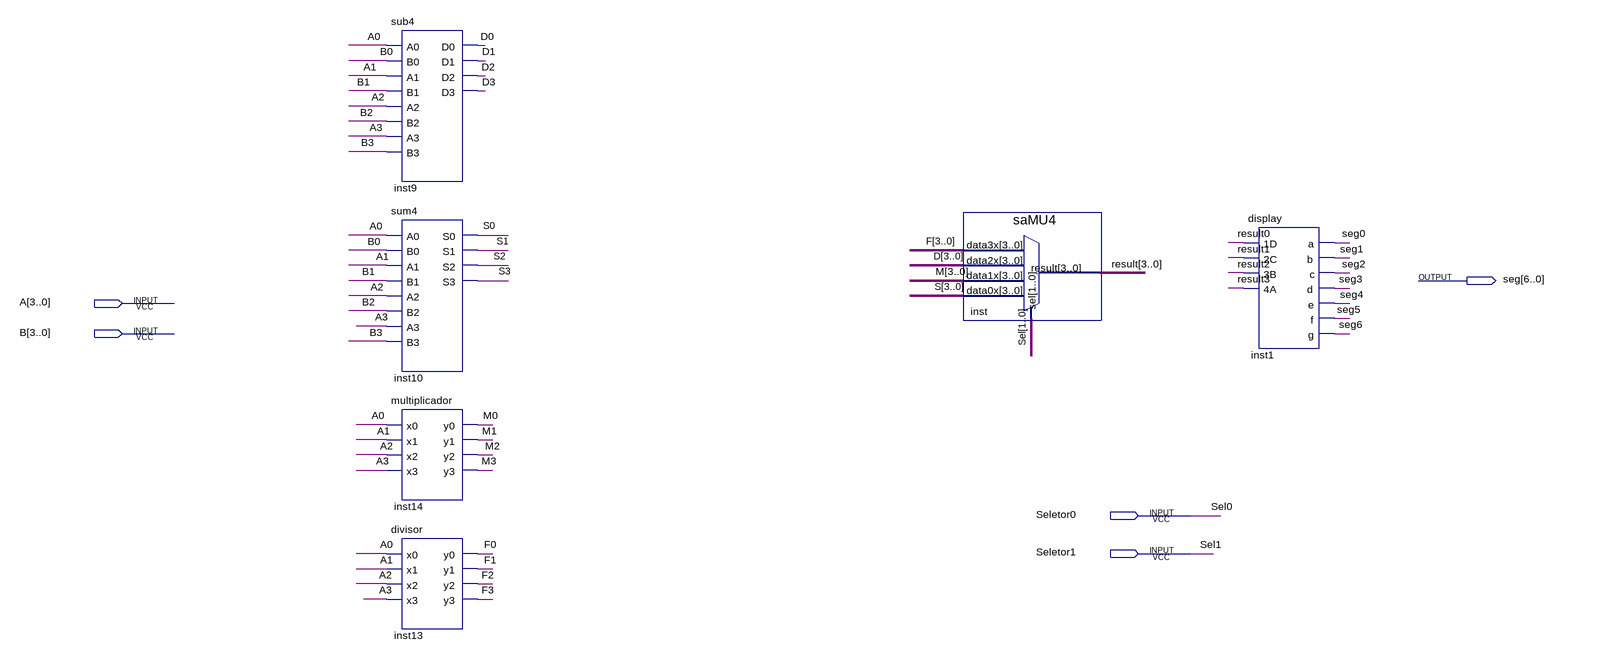
[diagram p0: schematic sheet]
// Quartus schematic ula.bdf as structural Verilog: 6 symbols, 5 pins
module ula (
  input  [3:0] A,
  input  [3:0] B,
  input  Seletor0,
  input  Seletor1,
  output [6:0] seg
);

  wire [3:0] D, F, M, result, S;

  sub4 inst9 (
    .A0(A[0]), .B0(B[0]), .A1(A[1]), .B1(B[1]), .A2(A[2]), .B2(B[2]), .A3(A[3]), .B3(B[3]), .D0(D[0]),
    .D1(D[1]), .D2(D[2]), .D3(D[3]));
  sum4 inst10 (
    .A0(A[0]), .B0(B[0]), .A1(A[1]), .B1(B[1]), .A2(A[2]), .B2(B[2]), .A3(A[3]), .B3(B[3]), .S0(S[0]),
    .S1(S[1]), .S2(S[2]), .S3(S[3]));
  multiplicador inst14 (.x0(A[0]), .x1(A[1]), .x2(A[2]), .x3(A[3]), .y0(M[0]), .y1(M[1]), .y2(M[2]), .y3(M[3]));
  divisor inst13 (.x0(A[0]), .x1(A[1]), .x2(A[2]), .x3(A[3]), .y0(F[0]), .y1(F[1]), .y2(F[2]), .y3(F[3]));
  saMU4 inst (.data3x(F), .data2x(D), .data1x(M), .data0x(S), .sel({Seletor1, Seletor0}), .result(result));
  display inst1 (
    .\1D (result[0]), .\2C (result[1]), .\3B (result[2]), .\4A (result[3]), .a(seg[0]), .b(seg[1]),
    .c(seg[2]), .d(seg[3]), .e(seg[4]), .f(seg[5]), .g(seg[6]));

  // Other names for the same wires on the sheet: Sel[1:0] = {Seletor1, Seletor0}; Sel0 = Seletor0; Sel1 = Seletor1
endmodule
